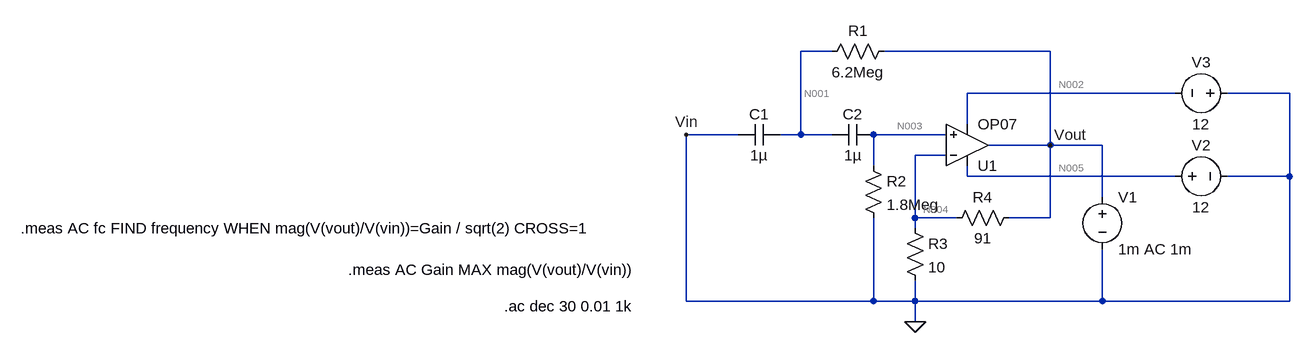
[diagram p0: schematic HF_ro.asc]
HF_ro.asc, the LTspice schematic file:
Version 4.1
SHEET 1 1300 680
WIRE 176 16 128 16
WIRE 512 16 256 16
WIRE 704 80 384 80
WIRE 880 80 784 80
WIRE 384 128 384 80
WIRE 32 144 -48 144
WIRE 128 144 128 16
WIRE 128 144 96 144
WIRE 176 144 128 144
WIRE 352 144 240 144
WIRE 512 160 512 16
WIRE 512 160 416 160
WIRE 592 160 512 160
WIRE 352 176 304 176
WIRE 240 192 240 144
WIRE 384 208 384 192
WIRE 704 208 384 208
WIRE 880 208 880 80
WIRE 880 208 784 208
WIRE 592 240 592 160
WIRE 304 272 304 176
WIRE 368 272 304 272
WIRE 512 272 512 160
WIRE 512 272 448 272
WIRE 304 288 304 272
WIRE -48 400 -48 144
WIRE 240 400 240 272
WIRE 240 400 -48 400
WIRE 304 400 304 368
WIRE 304 400 240 400
WIRE 592 400 592 320
WIRE 592 400 304 400
WIRE 880 400 880 208
WIRE 880 400 592 400
WIRE 304 432 304 400
FLAG 304 432 0
FLAG -48 144 Vin
FLAG 512 160 Vout
SYMBOL cap 96 128 R90
WINDOW 0 0 32 VBottom 2
WINDOW 3 32 32 VTop 2
SYMATTR InstName C1
SYMATTR Value 1µ
SYMBOL cap 240 128 R90
WINDOW 0 0 32 VBottom 2
WINDOW 3 32 32 VTop 2
SYMATTR InstName C2
SYMATTR Value 1µ
SYMBOL res 272 0 R90
WINDOW 0 0 56 VBottom 2
WINDOW 3 32 56 VTop 2
SYMATTR InstName R1
SYMATTR Value 6.2Meg
SYMBOL res 224 176 R0
SYMATTR InstName R2
SYMATTR Value 1.8Meg
SYMBOL res 288 272 R0
SYMATTR InstName R3
SYMATTR Value 10
SYMBOL res 464 256 R90
WINDOW 0 0 56 VBottom 2
WINDOW 3 32 56 VTop 2
SYMATTR InstName R4
SYMATTR Value 91
SYMBOL OpAmps\\OP07 384 224 M180
SYMATTR InstName U1
SYMBOL voltage 592 224 R0
SYMATTR InstName V1
SYMATTR Value 1m AC 1m
SYMBOL voltage 688 208 R270
WINDOW 0 32 56 VTop 2
WINDOW 3 -32 56 VBottom 2
SYMATTR InstName V2
SYMATTR Value 12
SYMBOL voltage 800 80 R90
WINDOW 0 -32 56 VBottom 2
WINDOW 3 32 56 VTop 2
SYMATTR InstName V3
SYMATTR Value 12
TEXT -328 408 Left 2 !.ac dec 30 0.01 1k
TEXT -568 352 Left 2 !.meas AC Gain MAX mag(V(vout)/V(vin))
TEXT -1072 288 Left 2 !.meas AC fc FIND frequency WHEN mag(V(vout)/V(vin))=Gain / sqrt(2) CROSS=1

The netlist it stands for:
* HF_ro.asc
C1 N001 0 1µ
C2 N003 N001 1µ
R1 Vout N001 6.2Meg
R2 N003 0 1.8Meg
R3 N004 0 10
R4 Vout N004 91
X§U1 N003 N004 N005 N002 Vout LT1001  ; OP07, pins In+ In- V+ V- OUT
V1 Vout 0 1m AC 1m
V2 N005 0 12
V3 0 N002 12
.ac dec 30 0.01 1k
.meas AC Gain MAX mag(V(vout)/V(vin))
.meas AC fc FIND frequency WHEN mag(V(vout)/V(vin))=Gain / sqrt(2) CROSS=1
.lib LTC.lib
.backanno
.end

* Results of the author's LTspice run, read from the files saved beside the schematic
* Operating Point, zero values left out:
*   V(n001) = 1 mV
*   V(n002) = -12 V
*   V(n003) = 2.349 µV
*   V(n004) = 99.01 µV
*   V(n005) = 12 V
*   V(vout) = 1 mV
*   I(R2) = 1.305 pA
*   I(R3) = 9.901 µA
*   I(R4) = 9.901 µA
*   I(V1) = -31.67 mA
*   I(V2) = -1.328 nA
*   I(V3) = -31.66 mA
*   Ix(u1:1) = -1.305 pA
*   Ix(u1:2) = 1.305 pA
*   Ix(u1:3) = 1.316 nA
*   Ix(u1:4) = -31.66 mA
*   Ix(u1:5) = 31.66 mA
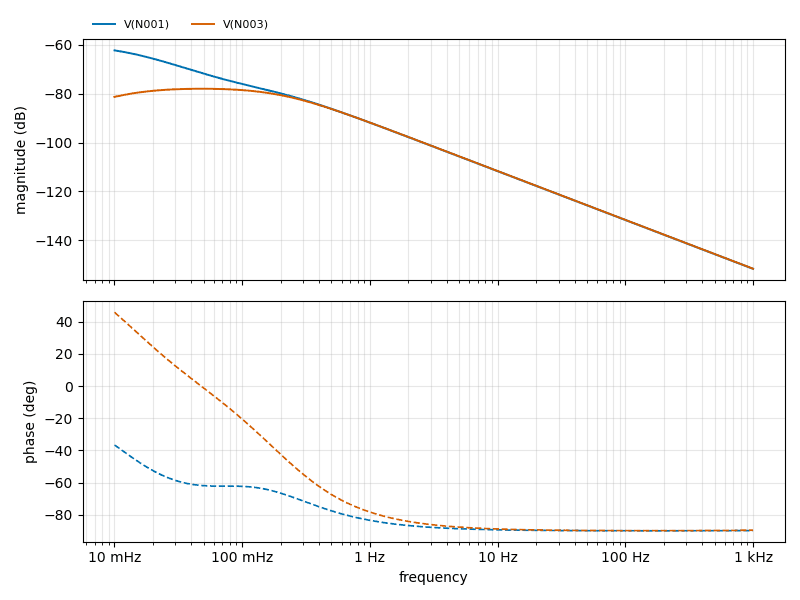
[diagram p1: AC Analysis of HF_ro.asc, plotted from the saved traces]
* AC Analysis, 1 run:
*   V(N001): -62.27 dB at 10 mHz, -151.74 dB at 1 kHz, peak -62.27 dB at 10 mHz, 3 dB below the peak at 18.81 mHz
*   V(N003): -81.32 dB at 10 mHz, -151.67 dB at 1 kHz, peak -77.98 dB at 46.42 mHz, 3 dB below the peak at 10.69 mHz and 217.5 mHz